# EAGLE schematic ch2 (EAGLE 9.2.2)
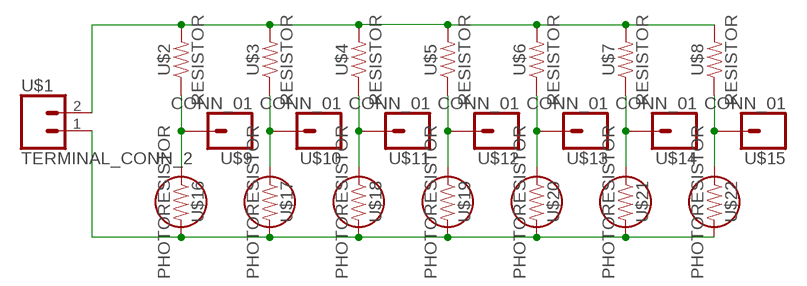
[diagram p0: schematic, sheet 1]

## Parts
U$1  TERMINAL_CONN_2  [TERMINAL_CONN_2]
U$2  RESISTOR  [RESISTOR]
U$3  RESISTOR  [RESISTOR]
U$4  RESISTOR  [RESISTOR]
U$5  RESISTOR  [RESISTOR]
U$6  RESISTOR  [RESISTOR]
U$7  RESISTOR  [RESISTOR]
U$8  RESISTOR  [RESISTOR]
U$9  CONN_01  [1X01]
U$10  CONN_01  [1X01]
U$11  CONN_01  [1X01]
U$12  CONN_01  [1X01]
U$13  CONN_01  [1X01]
U$14  CONN_01  [1X01]
U$15  CONN_01  [1X01]
U$16  PHOTORESISTOR  [PHOTORESISTOR]
U$17  PHOTORESISTOR  [PHOTORESISTOR]
U$18  PHOTORESISTOR  [PHOTORESISTOR]
U$19  PHOTORESISTOR  [PHOTORESISTOR]
U$20  PHOTORESISTOR  [PHOTORESISTOR]
U$21  PHOTORESISTOR  [PHOTORESISTOR]
U$22  PHOTORESISTOR  [PHOTORESISTOR]

## Nets
N$1: U$1.2 U$2.2 U$3.2 U$4.2 U$5.2 U$6.2 U$7.2 U$8.2
N$2: U$2.1 U$9.1 U$16.P$1
N$3: U$3.1 U$10.1 U$17.P$1
N$4: U$4.1 U$11.1 U$18.P$1
N$5: U$5.1 U$12.1 U$19.P$1
N$6: U$6.1 U$13.1 U$20.P$1
N$7: U$7.1 U$14.1 U$21.P$1
N$8: U$8.1 U$15.1 U$22.P$1
N$9: U$1.1 U$16.P$2 U$17.P$2 U$18.P$2 U$19.P$2 U$20.P$2 U$21.P$2 U$22.P$2

## Library data of the parts
U$1 = ECE5_WS(7):TERMINAL_CONN_2: 2 pin terminal block
U$2-U$8 = ECE5_WS(7):RESISTOR: This is a resistor
U$9-U$15 = ECE5_WS(7):CONN_01: Header Pin - 1
U$16-U$22 = ECE5_WS(7):PHOTORESISTOR: This is a photoresistor